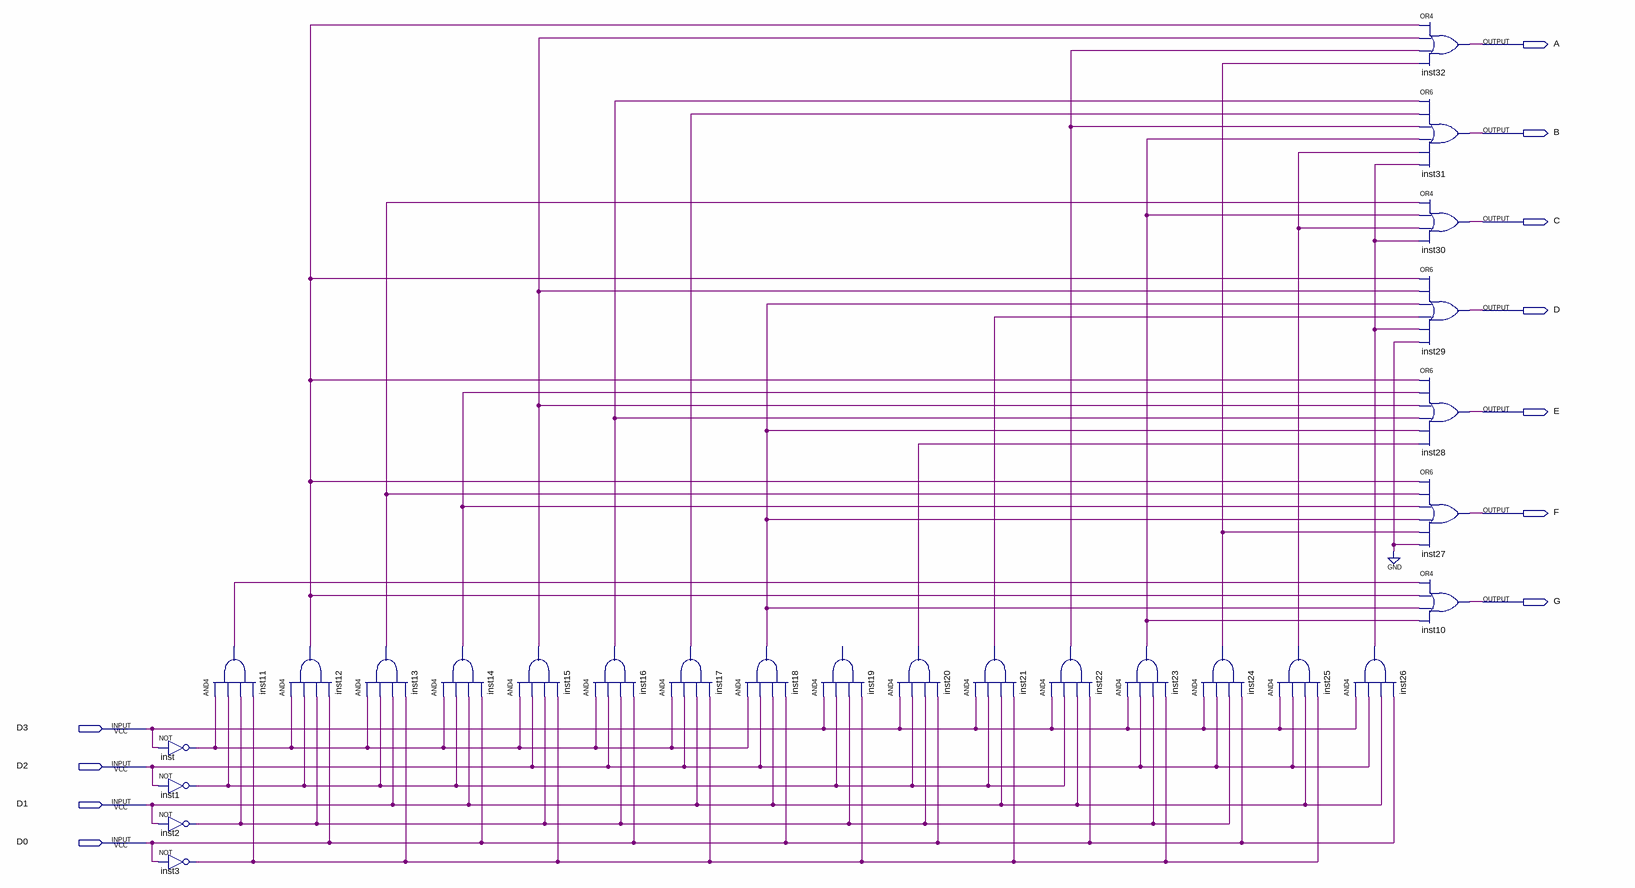
[diagram p0: schematic sheet]
// Quartus schematic my_dec7seg.bdf as structural Verilog: 27 symbols, 11 pins
module my_dec7seg (
  input  D3,
  input  D2,
  input  D1,
  input  D0,
  output A,
  output B,
  output C,
  output D,
  output E,
  output F,
  output G
);

  wire inst1_out, inst2_out, inst3_out, inst11_out, inst12_out, inst13_out, inst14_out, inst15_out,
       inst16_out, inst17_out, inst18_out, inst20_out, inst21_out, inst22_out, inst23_out, inst24_out,
       inst25_out, inst26_out, inst_out;

  not inst (inst_out, D3);
  not inst1 (inst1_out, D2);
  not inst2 (inst2_out, D1);
  not inst3 (inst3_out, D0);
  and inst11 (inst11_out, inst_out, inst1_out, inst2_out, inst3_out);
  and inst12 (inst12_out, inst_out, inst1_out, inst2_out, D0);
  and inst13 (inst13_out, inst_out, inst1_out, D1, inst3_out);
  and inst14 (inst14_out, inst_out, inst1_out, D1, D0);
  and inst15 (inst15_out, inst_out, D2, inst2_out, inst3_out);
  and inst16 (inst16_out, inst_out, D2, inst2_out, D0);
  and inst17 (inst17_out, inst_out, D2, D1, inst3_out);
  and inst18 (inst18_out, inst_out, D2, D1, D0);
  // AND4 inst19 has open pins: IN1=D3, IN2=inst1_out, IN3=inst2_out, IN4=inst3_out, OUT=open
  and inst20 (inst20_out, D3, inst1_out, inst2_out, D0);
  and inst21 (inst21_out, D3, inst1_out, D1, inst3_out);
  and inst22 (inst22_out, D3, inst1_out, D1, D0);
  and inst23 (inst23_out, D3, D2, inst2_out, inst3_out);
  and inst24 (inst24_out, D3, D2, inst2_out, D0);
  and inst25 (inst25_out, D3, D2, D1, inst3_out);
  and inst26 (inst26_out, D3, D2, D1, D0);
  or inst32 (A, inst12_out, inst15_out, inst22_out, inst24_out);
  or inst31 (B, inst16_out, inst17_out, inst22_out, inst23_out, inst25_out, inst26_out);
  or inst30 (C, inst13_out, inst23_out, inst25_out, inst26_out);
  or inst29 (D, inst12_out, inst15_out, inst18_out, inst21_out, inst26_out, 1'b0);
  or inst28 (E, inst12_out, inst14_out, inst15_out, inst16_out, inst18_out, inst20_out);
  or inst27 (F, inst12_out, inst13_out, inst14_out, inst18_out, inst24_out, 1'b0);
  or inst10 (G, inst11_out, inst12_out, inst18_out, inst23_out);
endmodule
